# Altium schematic sheet charge_battery.SchDoc
size A4
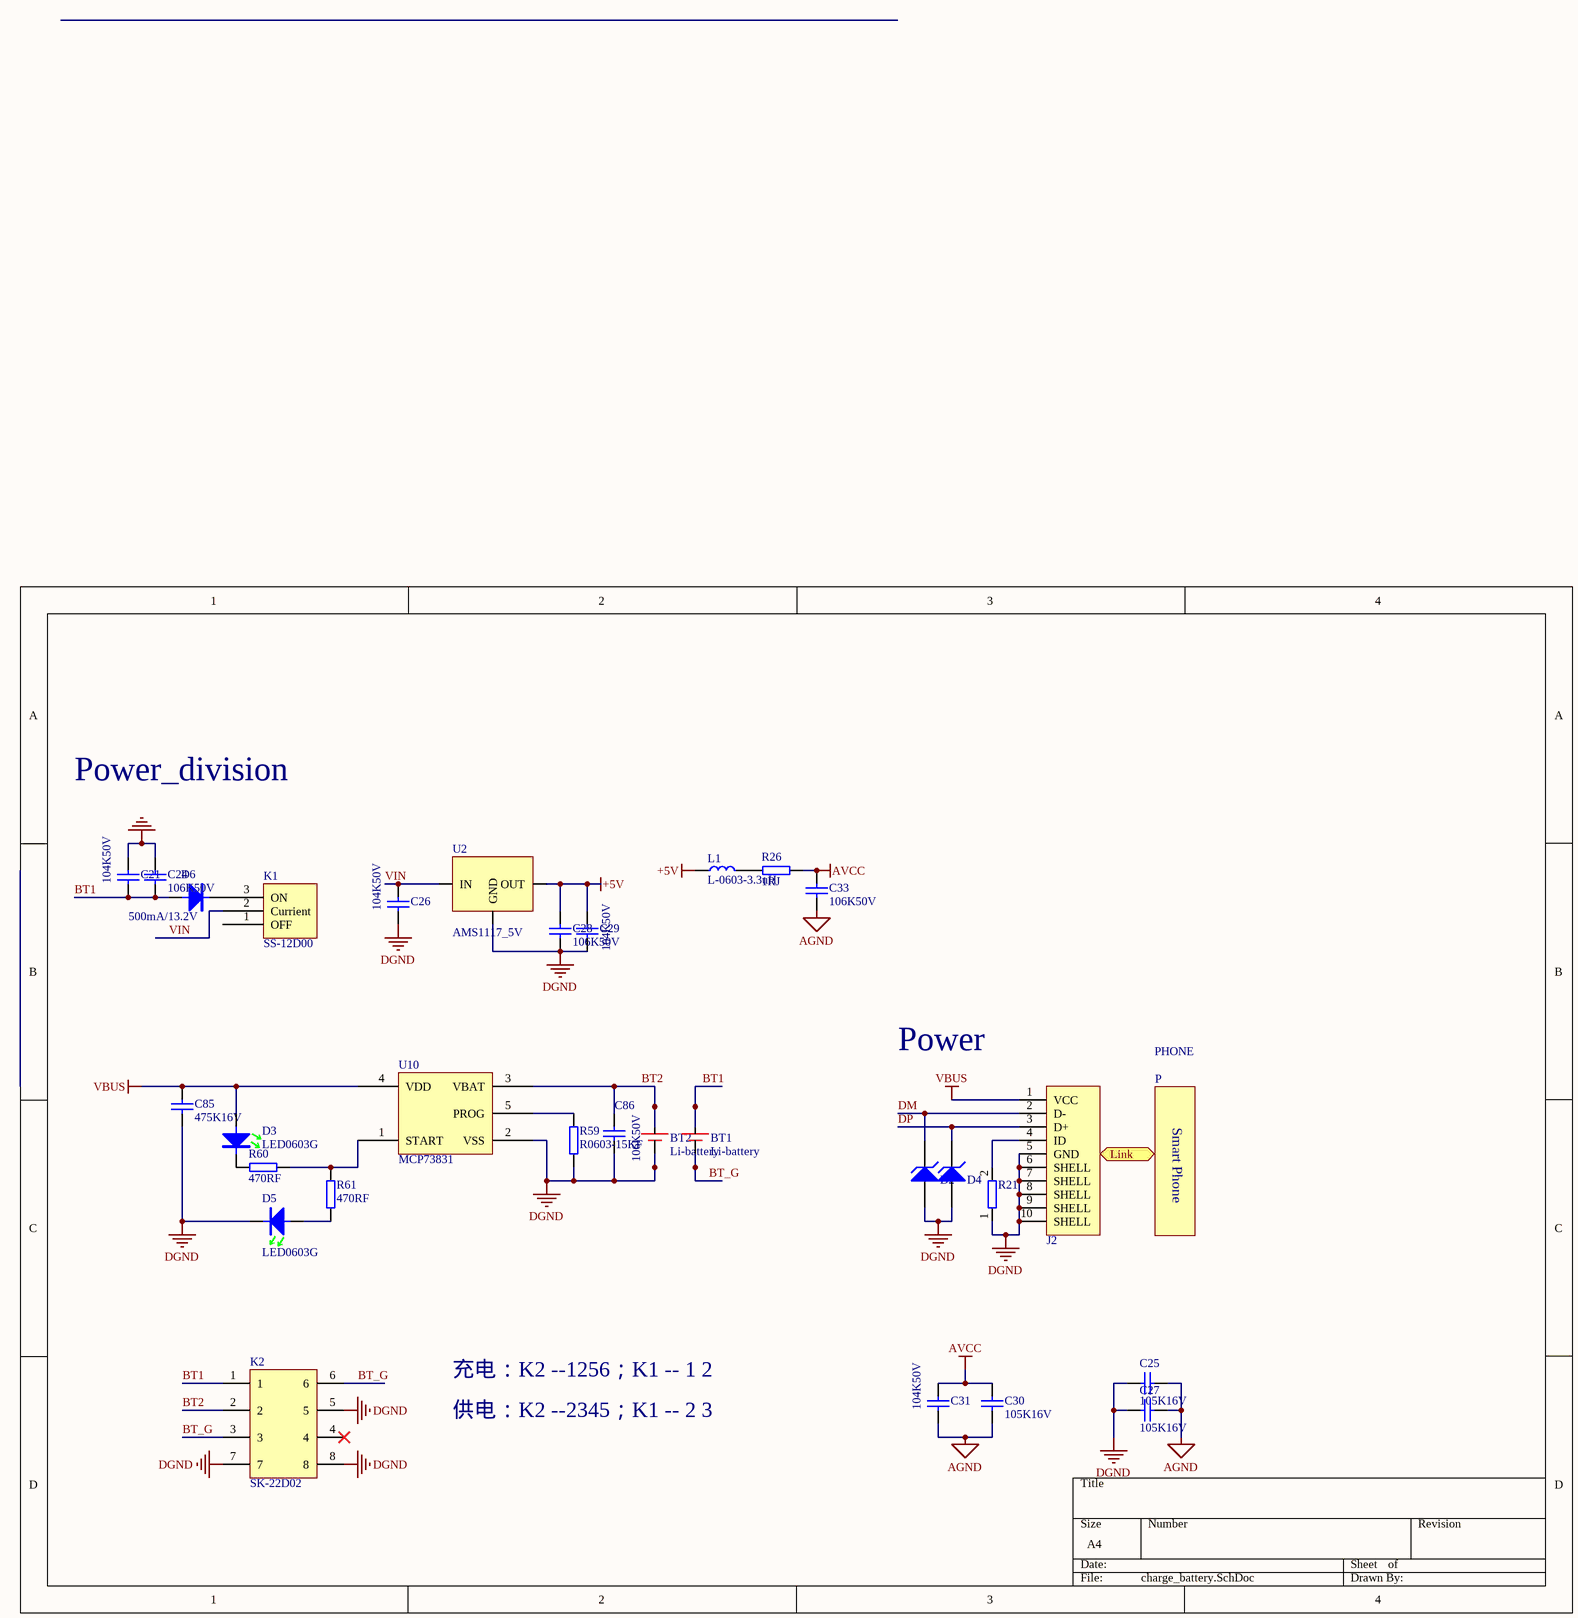
[diagram p0: charge_battery.SchDoc]

## Parts
BT1  Li-battery  [LIR2032]
BT2  Li-battery  [LIR2032]
C21  104K50V  [C0603]
C24  106K50V  [C0603]
C25  105K16V  [C0603]
C26  104K50V  [C0603]
C27  105K16V  [C0603]
C28  106K50V  [C0603]
C29  104K50V  [C0603]
C30  105K16V  [C0603]
C31  104K50V  [C0603]
C33  106K50V  [C0603]
C85  475K16V  [C0603]
C86  106K50V  [C0603]
D2  ESDA_TR1/0603  [HS_0603D]  (value not drawn)
D3  LED0603G  [D-LED0603G]
D4  ESDA_TR1/0603  [HS_0603D]  (value not drawn)
D5  LED0603G  [D-LED0603G]
D6  500mA/13.2V  [D1206]
J2  USB-MINI-SOCKET  [MICRO-USB - 5.9]  (value not drawn)
K1  SS-12D00  [SS-12D00]
K2  SK-22D02  [SK-22D02]
L1  L-0603-3.3uH  [L0603]
P  PHONE
R21  0R  [R0603]  (value not drawn)
R26  1RJ  [R0603]
R59  R0603-15KF  [R0603]
R60  470RF  [R0603]
R61  470RF  [R0603]
U2  AMS1117_5V  [SOT-223]
U10  MCP73831  [SOT23-5N]

## Ports
Link

## Nets
+5V: C28.2 C29.1 L1.1 U2.2(OUT)
AGND: C25.2 C27.2 C30.2 C31.2 C33.1
AVCC: C30.1 C31.1 C33.2 R26.1
DGND: BT2.2 C21.1 C24.2 C25.1 C26.2 C27.1 C28.1 C29.2 C85.2 C86.2 D2.1(A) D4.1(A) D5.2 J2.5(GND) J2.6(SHELL) J2.7(SHELL) J2.8(SHELL) J2.9(SHELL) J2.10(SHELL) K2.5 K2.7 K2.8 R21.1 R59.1 U2.1(GND) U10.2(VSS)
VBUS: C85.1 D3.1 J2.1(VCC) U10.4(VDD)
BT1: BT1.1 C21.2 C24.1 D6.1 K2.1
BT2: BT2.1 C86.1 K2.2 U10.3(VBAT)
BT_G: BT1.2 K2.3 K2.6
DM: D2.2(K) J2.2(D-)
DP: D4.2(K) J2.3(D+)
VIN: C26.1 K1.2(Currient) U2.3(IN)
NetD3_2: D3.2 R60.1
NetD5_1: D5.1 R61.1
NetD6_2: D6.2 K1.3(ON)
NetJ2_4: J2.4(ID) R21.2
NetL1_2: L1.2 R26.2
NetR59_2: R59.2 U10.5(PROG)
NetR60_2: R60.2 R61.2 U10.1(START)

Not connected (* = marked no-connect by the designer): K1 1(OFF); K2 4*

## Notes on the sheet
- Power_division
- Power
- 充电：K2 --1256；K1 -- 1 2
- 供电：K2 --2345；K1 -- 2 3
- (in symbol PHONE) Smart Phone

## Library data of the parts
BT1 BT2 = Li-batttery: 纽扣电池LIR2023
C21 C26 C29 C31 = C0603X7R-104K50V: 贴片电容-陶瓷; 规格型号: 100nF±10%_50V_X7R_C0603; 生产商: 风华 三星; 供应商: *; 备注: *
C24 C28 C33 C86 = C0603X7R-106K50V: 贴片电容-陶瓷; 规格型号: 10uF±10%_50V_X7R_C0603; 生产商: 风华 三星; 供应商: *; 备注: *
C25 C27 C30 = C0603X7R-105K16V: 贴片电容-陶瓷; 规格型号: 1uF±10%_16V_X7R_C0603; 生产商: 风华 三星; 供应商: *; 备注: *
C85 = C0603X7R-475K16V: 贴片电容-陶瓷; 规格型号: 4.7uF±10%_16V_X7R_C0603; 生产商: 风华 三星; 供应商: *; 备注: *
D2 D4 = D Zener: Zener Diode; Published: *; LatestRevisionDate: *; LatestRevisionNote: *; PackageReference: *; Publisher: *
D3 D5 = DLED-0603-G: 贴片二极管-LED; 规格型号: 0603-GREEN; 货品编码: 无样品无编码; 生产商: *; 供应商: *; 备注: *
D6 = 1206MSD: 500mA/13.2V 自恢复保险丝
J2 = J-USB-MINI-SOCKET: USB-A卧式插座; 供应商: *; 备注: *
K1 = SS-12D00(1P2T) 立式 柄高5MM
K2 = SK-22D02: 波动开关-2档6脚
L1 = L-0603-3.3uH: 贴片电感-屏蔽; 生产商: *; 供应商: *; 备注: *
R21 = R0603-0R: 贴片电阻-通用; 生产商: 厚声 国巨; 规格型号: 0R_1/10W_±200ppm_R0603; 货品编码: 无样品无编码; 备注: *; 供应商: *
R26 = R0603-1RJ: 贴片电阻-通用; 生产商: 厚声 国巨; 规格型号: 1R±5%_1/10W_±200ppm_R0603; 货品编码: 无样品无编码; 备注: *; 供应商: *
R59 = R0603-15KF: 贴片电容-通用
R60 R61 = R0603-470RF: 贴片电阻-通用; 生产商: 厚声 国巨; 规格型号: 470R±1%_1/10W_±200ppm_R0603; 货品编码: 无样品无编码; 备注: *; 供应商: *
U2 = AMS1117-5V
U10 = MCP73831: charge IC